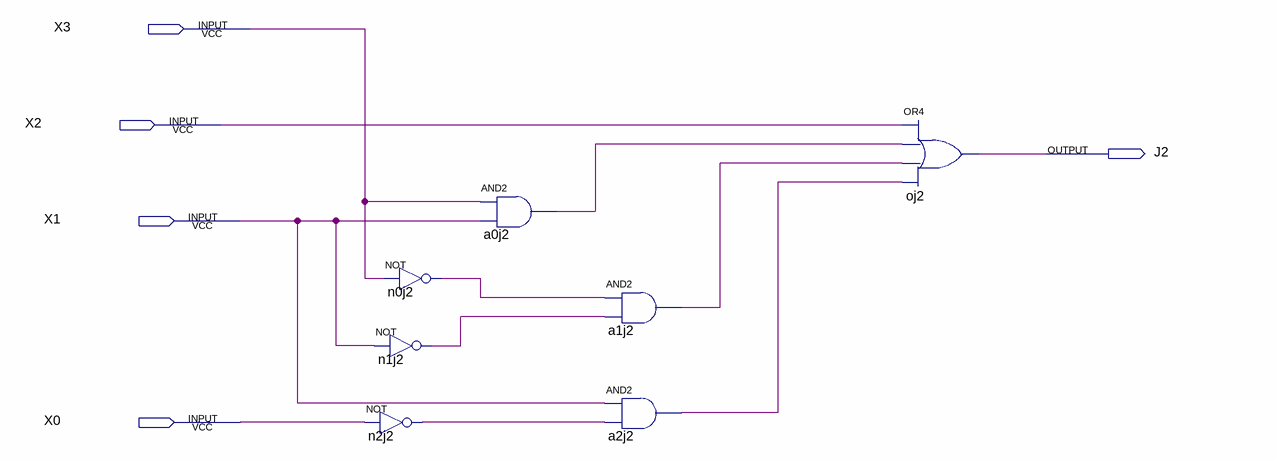
[diagram p0: schematic sheet]
// Quartus schematic J2.bdf as structural Verilog: 7 symbols, 5 pins
module J2 (
  input  X3,
  input  X2,
  input  X1,
  input  X0,
  output J2
);

  wire a0j2_out, a1j2_out, a2j2_out, n0j2_out, n1j2_out, n2j2_out;

  not n0j2 (n0j2_out, X3);
  not n1j2 (n1j2_out, X1);
  not n2j2 (n2j2_out, X0);
  and a0j2 (a0j2_out, X3, X1);
  and a1j2 (a1j2_out, n0j2_out, n1j2_out);
  and a2j2 (a2j2_out, X1, n2j2_out);
  or oj2 (J2, X2, a0j2_out, a1j2_out, a2j2_out);
endmodule
